# EAGLE schematic Cape (EAGLE 7.2.0)
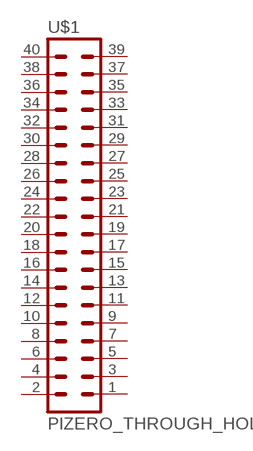
[diagram p0: schematic, sheet 1]

## Parts
U$1  PIZERO_THROUGH_HOLE  [PIZERO_THOUGH_HOLE]
Unconnected: U$1.1 U$1.2 U$1.3 U$1.4 U$1.5 U$1.6 U$1.7 U$1.8 U$1.9 U$1.10 U$1.11 U$1.12 U$1.13 U$1.14 U$1.15 U$1.16 U$1.17 U$1.18 U$1.19 U$1.20 U$1.21 U$1.22 U$1.23 U$1.24 U$1.25 U$1.26 U$1.27 U$1.28 U$1.29 U$1.30 U$1.31 U$1.32 U$1.33 U$1.34 U$1.35 U$1.36 U$1.37 U$1.38 U$1.39 U$1.40

## Library data of the parts
U$1 = pizero:PIZERO_THROUGH_HOLE